# EAGLE schematic msc_onlab106 (EAGLE 6.1)
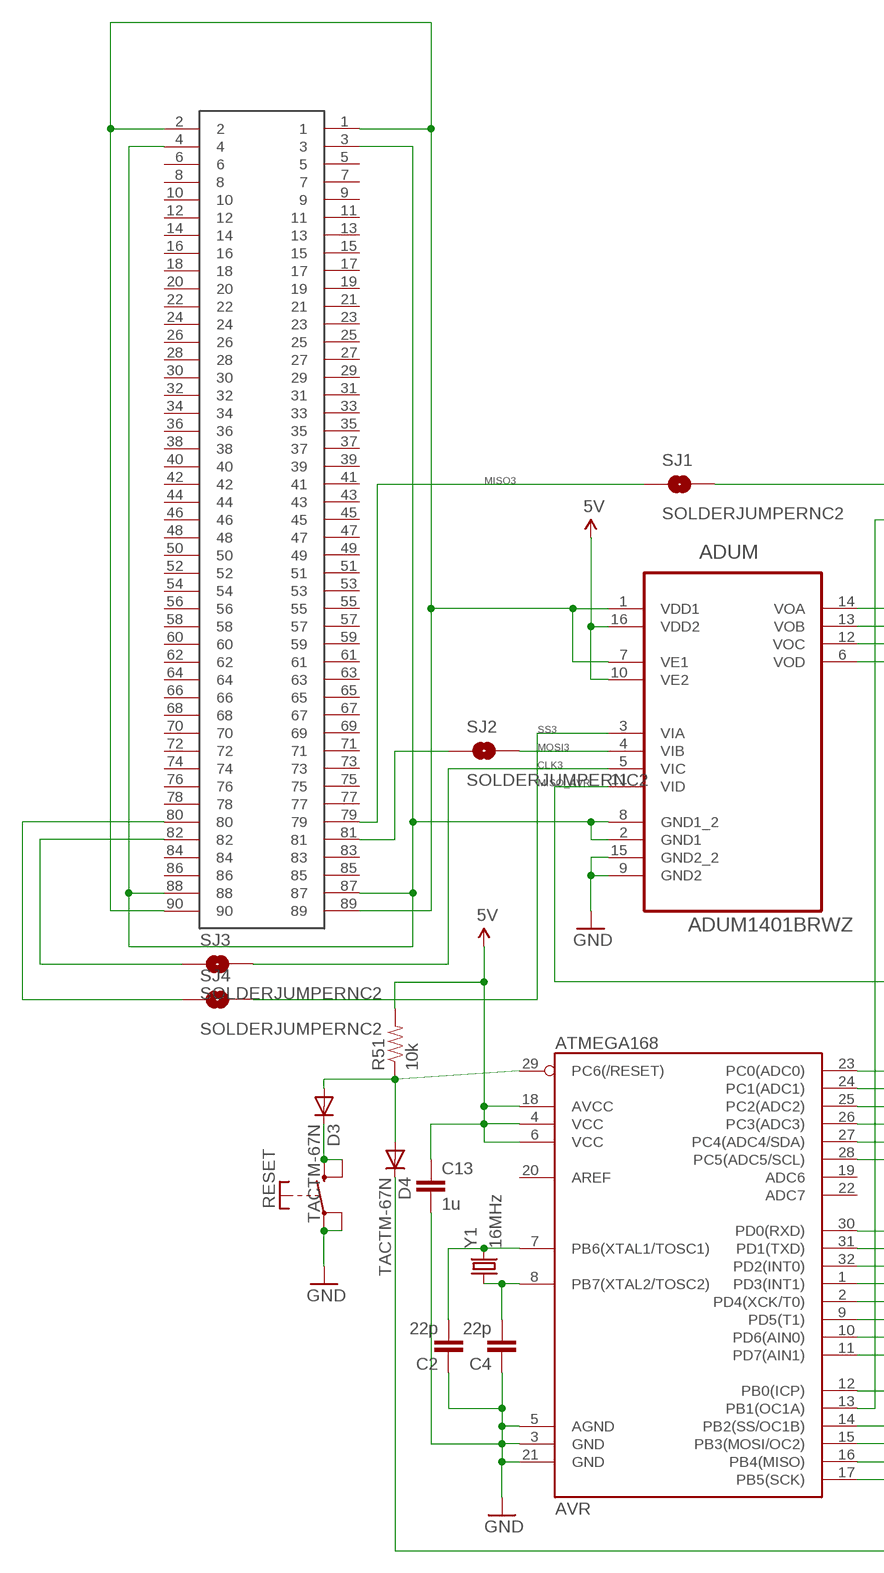
[diagram p0: schematic, sheet 1, part 1 of 2]
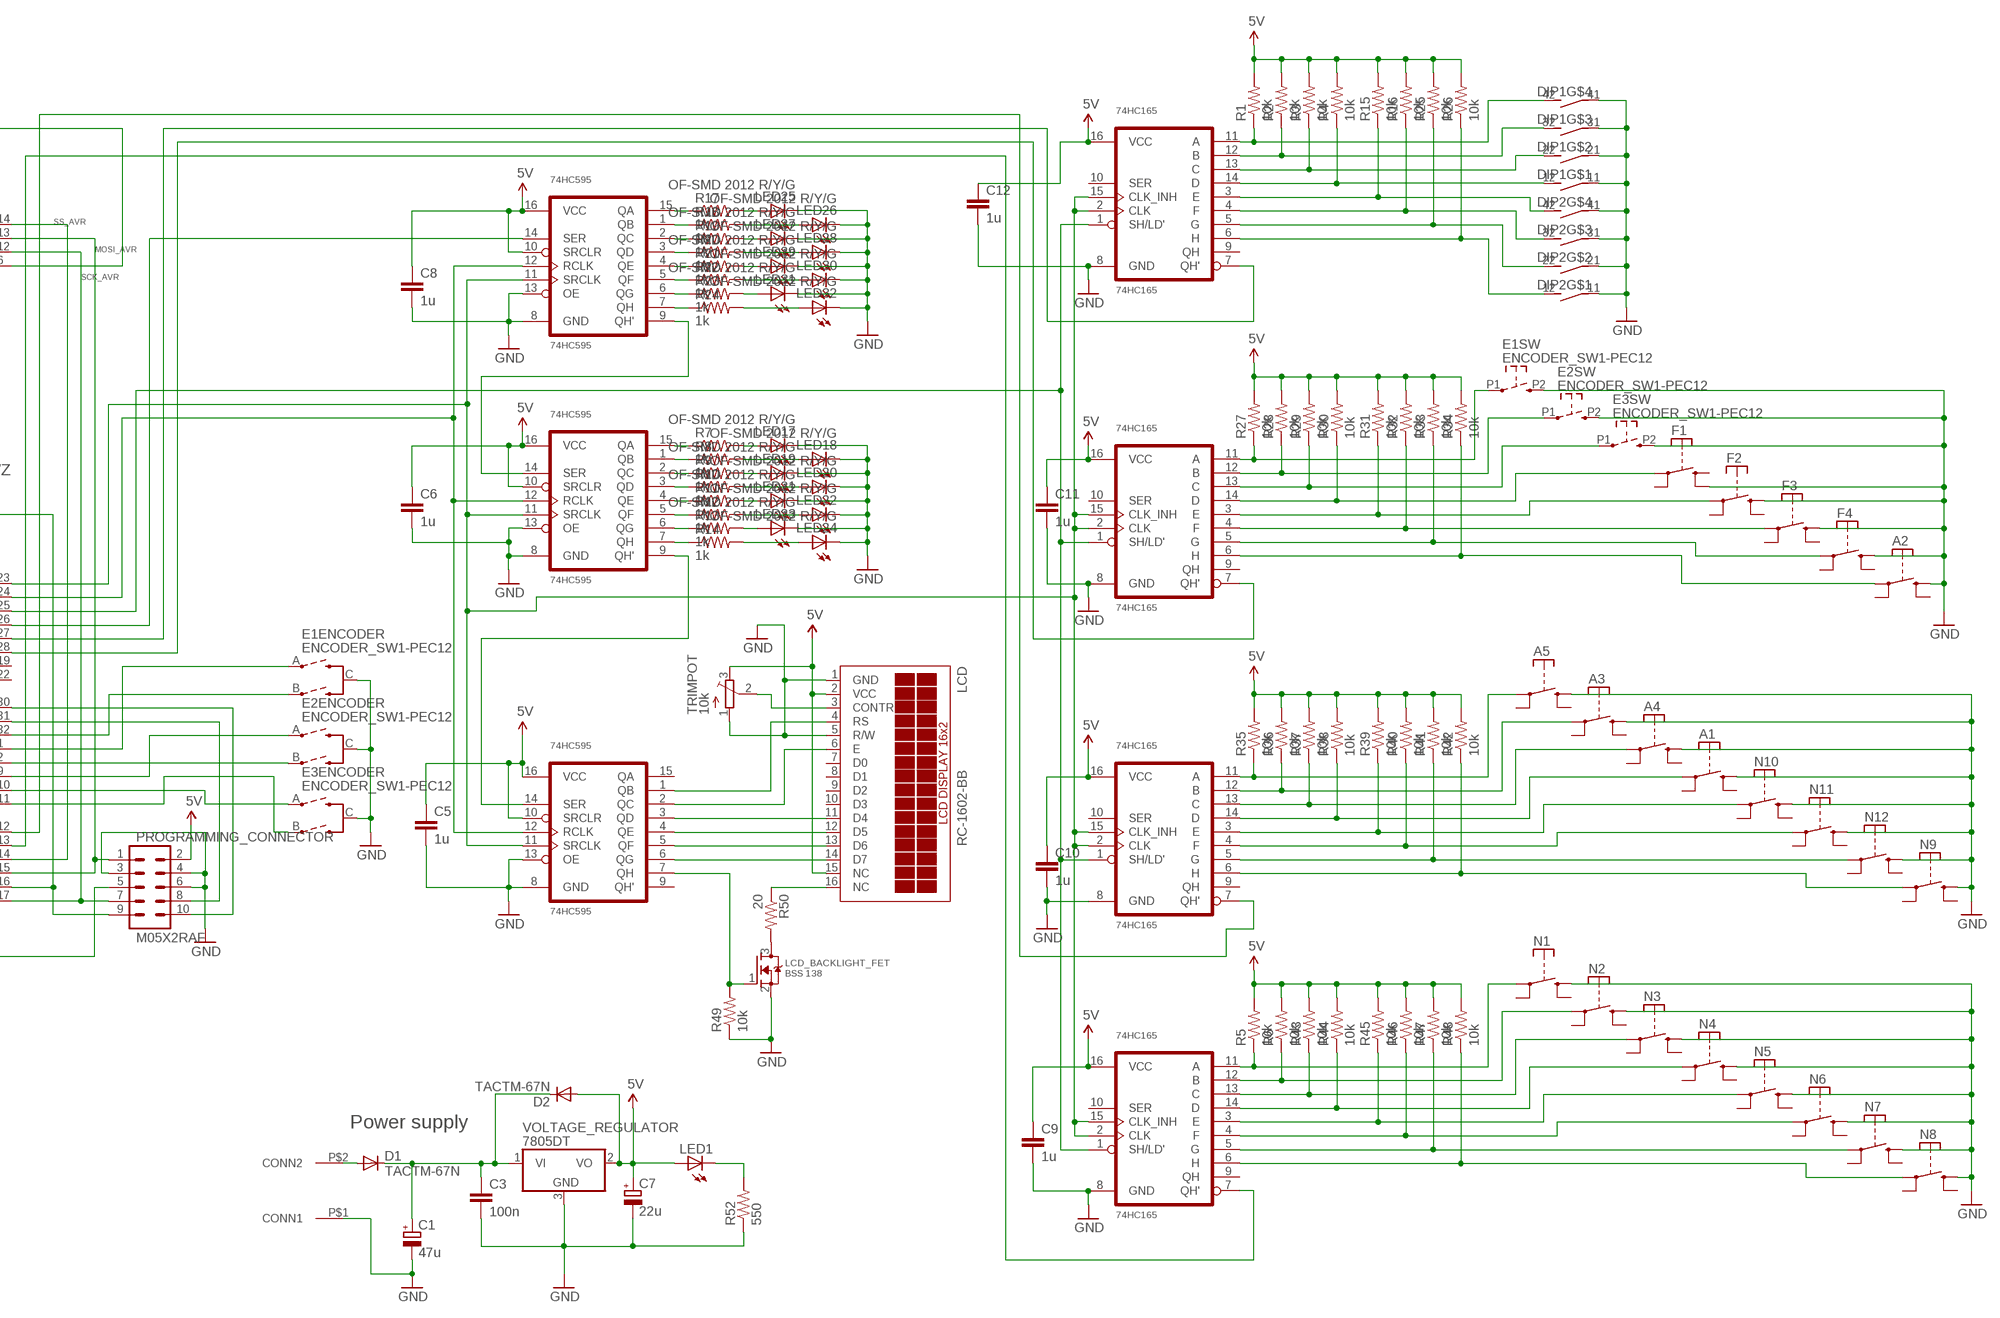
[diagram p1: schematic, sheet 1, part 2 of 2]

## Parts
A1  TACTM-67N  BUTTON_SMD  [SMD]
A2  TACTM-67N  BUTTON_SMD  [SMD]
A3  TACTM-67N  BUTTON_SMD  [SMD]
A4  TACTM-67N  BUTTON_SMD  [SMD]
A5  TACTM-67N  BUTTON_SMD  [SMD]
ADUM  ADUM1401BRWZ  [SOIC127P1032X265-16N]
AVR  ATMEGA168  [TQFP32-08]
C1  47u  CPOL-EUD/7343-31W  [D/7343-31W]
C2  22p  CAP0603-CAP  [0603-CAP]
C3  100n  C-EUC0805K  [C0805K]
C4  22p  CAP0603-CAP  [0603-CAP]
C5  1u  CAP0603-CAP  [0603-CAP]
C6  1u  CAP0603-CAP  [0603-CAP]
C7  22u  CPOL-EUSMCB  [SMC_B]
C8  1u  CAP0603-CAP  [0603-CAP]
C9  1u  CAP0603-CAP  [0603-CAP]
C10  1u  CAP0603-CAP  [0603-CAP]
C11  1u  CAP0603-CAP  [0603-CAP]
C12  1u  CAP0603-CAP  [0603-CAP]
C13  1u  CAP0603-CAP  [0603-CAP]
CONNECTOR  SAMTEC_TFC  [SAMTEC-TFC]
D1  TACTM-67N  DIODESMA-ALT  [SMA-DIODE_ALT]
D2  TACTM-67N  DIODESMA-ALT  [SMA-DIODE_ALT]
D3  TACTM-67N  DIODESMA-ALT  [SMA-DIODE_ALT]
D4  TACTM-67N  DIODESMA-ALT  [SMA-DIODE_ALT]
DIP1  DIP04PIANO  [DIP04PIANO]
DIP2  DIP04PIANO  [DIP04PIANO]
E1  ENCODER_SW1-PEC12  [PEC12_INCREMENTAL_ENCODER]
E2  ENCODER_SW1-PEC12  [PEC12_INCREMENTAL_ENCODER]
E3  ENCODER_SW1-PEC12  [PEC12_INCREMENTAL_ENCODER]
F1  TACTM-67N  BUTTON_SMD  [SMD]
F2  TACTM-67N  BUTTON_SMD  [SMD]
F3  TACTM-67N  BUTTON_SMD  [SMD]
F4  TACTM-67N  BUTTON_SMD  [SMD]
IN_1  74HC165  [TI_PW]
IN_2  74HC165  [TI_PW]
IN_3  74HC165  [TI_PW]
IN_4  74HC165  [TI_PW]
LCD  RC-1602-BB  TUXGR_16X2_R2  [TUXGR_16X2_R2]
LCD_BACKLIGHT_FET  BSS 138  MOSFET-NREFLOW  [SOT23]
LED1  LEDCHIPLED_0805  [CHIPLED_0805]
LED17  OF-SMD 2012 R/Y/G  LEDCHIPLED_0805  [CHIPLED_0805]
LED18  OF-SMD 2012 R/Y/G  LEDCHIPLED_0805  [CHIPLED_0805]
LED19  OF-SMD 2012 R/Y/G  LEDCHIPLED_0805  [CHIPLED_0805]
LED20  OF-SMD 2012 R/Y/G  LEDCHIPLED_0805  [CHIPLED_0805]
LED21  OF-SMD 2012 R/Y/G  LEDCHIPLED_0805  [CHIPLED_0805]
LED22  OF-SMD 2012 R/Y/G  LEDCHIPLED_0805  [CHIPLED_0805]
LED23  OF-SMD 2012 R/Y/G  LEDCHIPLED_0805  [CHIPLED_0805]
LED24  OF-SMD 2012 R/Y/G  LEDCHIPLED_0805  [CHIPLED_0805]
LED25  OF-SMD 2012 R/Y/G  LEDCHIPLED_0805  [CHIPLED_0805]
LED26  OF-SMD 2012 R/Y/G  LEDCHIPLED_0805  [CHIPLED_0805]
LED27  OF-SMD 2012 R/Y/G  LEDCHIPLED_0805  [CHIPLED_0805]
LED28  OF-SMD 2012 R/Y/G  LEDCHIPLED_0805  [CHIPLED_0805]
LED29  OF-SMD 2012 R/Y/G  LEDCHIPLED_0805  [CHIPLED_0805]
LED30  OF-SMD 2012 R/Y/G  LEDCHIPLED_0805  [CHIPLED_0805]
LED31  OF-SMD 2012 R/Y/G  LEDCHIPLED_0805  [CHIPLED_0805]
LED32  OF-SMD 2012 R/Y/G  LEDCHIPLED_0805  [CHIPLED_0805]
N1  TACTM-67N  BUTTON_SMD  [SMD]
N2  TACTM-67N  BUTTON_SMD  [SMD]
N3  TACTM-67N  BUTTON_SMD  [SMD]
N4  TACTM-67N  BUTTON_SMD  [SMD]
N5  TACTM-67N  BUTTON_SMD  [SMD]
N6  TACTM-67N  BUTTON_SMD  [SMD]
N7  TACTM-67N  BUTTON_SMD  [SMD]
N8  TACTM-67N  BUTTON_SMD  [SMD]
N9  TACTM-67N  BUTTON_SMD  [SMD]
N10  TACTM-67N  BUTTON_SMD  [SMD]
N11  TACTM-67N  BUTTON_SMD  [SMD]
N12  TACTM-67N  BUTTON_SMD  [SMD]
POWER_CONNECTOR  NSL39_2_CONNECTOR  [NSL39_2_CONNECTOR]
PROGRAMMING_CONNECTOR  M05X2RAF  [2X5-RAF]
R1  10k  RESISTOR0603-RES  [0603-RES]
R2  10k  RESISTOR0603-RES  [0603-RES]
R3  10k  RESISTOR0603-RES  [0603-RES]
R4  10k  RESISTOR0603-RES  [0603-RES]
R5  10k  RESISTOR0603-RES  [0603-RES]
R6  10k  RESISTOR0603-RES  [0603-RES]
R7  1k  RESISTOR0603-RES  [0603-RES]
R8  1k  RESISTOR0603-RES  [0603-RES]
R9  1k  RESISTOR0603-RES  [0603-RES]
R10  1k  RESISTOR0603-RES  [0603-RES]
R11  1k  RESISTOR0603-RES  [0603-RES]
R12  1k  RESISTOR0603-RES  [0603-RES]
R13  1k  RESISTOR0603-RES  [0603-RES]
R14  1k  RESISTOR0603-RES  [0603-RES]
R15  10k  RESISTOR0603-RES  [0603-RES]
R16  10k  RESISTOR0603-RES  [0603-RES]
R17  1k  RESISTOR0603-RES  [0603-RES]
R18  1k  RESISTOR0603-RES  [0603-RES]
R19  1k  RESISTOR0603-RES  [0603-RES]
R20  1k  RESISTOR0603-RES  [0603-RES]
R21  1k  RESISTOR0603-RES  [0603-RES]
R22  1k  RESISTOR0603-RES  [0603-RES]
R23  1k  RESISTOR0603-RES  [0603-RES]
R24  1k  RESISTOR0603-RES  [0603-RES]
R25  10k  RESISTOR0603-RES  [0603-RES]
R26  10k  RESISTOR0603-RES  [0603-RES]
R27  10k  RESISTOR0603-RES  [0603-RES]
R28  10k  RESISTOR0603-RES  [0603-RES]
R29  10k  RESISTOR0603-RES  [0603-RES]
R30  10k  RESISTOR0603-RES  [0603-RES]
R31  10k  RESISTOR0603-RES  [0603-RES]
R32  10k  RESISTOR0603-RES  [0603-RES]
R33  10k  RESISTOR0603-RES  [0603-RES]
R34  10k  RESISTOR0603-RES  [0603-RES]
R35  10k  RESISTOR0603-RES  [0603-RES]
R36  10k  RESISTOR0603-RES  [0603-RES]
R37  10k  RESISTOR0603-RES  [0603-RES]
R38  10k  RESISTOR0603-RES  [0603-RES]
R39  10k  RESISTOR0603-RES  [0603-RES]
R40  10k  RESISTOR0603-RES  [0603-RES]
R41  10k  RESISTOR0603-RES  [0603-RES]
R42  10k  RESISTOR0603-RES  [0603-RES]
R43  10k  RESISTOR0603-RES  [0603-RES]
R44  10k  RESISTOR0603-RES  [0603-RES]
R45  10k  RESISTOR0603-RES  [0603-RES]
R46  10k  RESISTOR0603-RES  [0603-RES]
R47  10k  RESISTOR0603-RES  [0603-RES]
R48  10k  RESISTOR0603-RES  [0603-RES]
R49  10k  RESISTOR0603-RES  [0603-RES]
R50  20  RESISTOR0603-RES  [0603-RES]
R51  10k  RESISTOR0603-RES  [0603-RES]
R52  550  RESISTOR0603-RES  [0603-RES]
RESET  NSG 39-2  BUTTON_SMD  [SMD]
SJ1  SOLDERJUMPERNC2  [SJ_2S-NOTRACE]
SJ2  SOLDERJUMPERNC2  [SJ_2S-NOTRACE]
SJ3  SOLDERJUMPERNC2  [SJ_2S-NOTRACE]
SJ4  SOLDERJUMPERNC2  [SJ_2S-NOTRACE]
SR_OUT1  74HC595  [TI_PW]
SR_OUT2  74HC595  [TI_PW]
SR_OUT3  74HC595  [TI_PW]
TRIMPOT  10k  TRIMPOTTC33X  [TC33X]
VOLTAGE_REGULATOR  7805DT  [TO252]
Y1  16MHz  CRYSTALSMD  [HC49UP]

## Nets
3V3: ADUM.1(VDD1) ADUM.7(VE1) CONNECTOR.1 CONNECTOR.2 CONNECTOR.89 CONNECTOR.90
3V3_GND: ADUM.2(GND1) ADUM.8(GND1_2) CONNECTOR.3 CONNECTOR.4 CONNECTOR.87 CONNECTOR.88
5V: ADUM.10(VE2) ADUM.16(VDD2) AVR.4(VCC) AVR.6(VCC) AVR.18(AVCC) C5.1 C6.1 C7.+ C8.1 C9.1 C10.1 C11.1 C12.1 C13.1 D2.A IN_1.16(VCC) IN_2.16(VCC) IN_3.16(VCC) IN_4.16(VCC) LCD.2(VCC) LCD.15(NC) LED1.A PROGRAMMING_CONNECTOR.2 R1.2 R2.2 R3.2 R4.2 R5.2 R6.2 R15.2 R16.2 R25.2 R26.2 R27.2 R28.2 R29.2 R30.2 R31.2 R32.2 R33.2 R34.2 R35.2 R36.2 R37.2 R38.2 R39.2 R40.2 R41.2 R42.2 R43.2 R44.2 R45.2 R46.2 R47.2 R48.2 R51.2 SR_OUT1.10(SRCLR) SR_OUT1.16(VCC) SR_OUT2.10(SRCLR) SR_OUT2.16(VCC) SR_OUT3.10(SRCLR) SR_OUT3.16(VCC) TRIMPOT.3(E) VOLTAGE_REGULATOR.2(VO)
CLK3: ADUM.5(VIC) SJ3.2
GND: A1.P$4(P) A2.P$4(P) A3.P$4(P) A4.P$4(P) A5.P$4(P) ADUM.9(GND2) ADUM.15(GND2_2) AVR.3(GND) AVR.5(AGND) AVR.21(GND) C1.- C2.1 C3.2 C4.1 C5.2 C6.2 C7.- C8.2 C9.2 C10.2 C11.2 C12.2 C13.2 DIP1.11 DIP1.21 DIP1.31 DIP1.41 DIP2.11 DIP2.21 DIP2.31 DIP2.41 E1.C(ENCODER:C) E1.P2 E2.C(ENCODER:C) E2.P2 E3.C(ENCODER:C) E3.P2 F1.P$3(P) F2.P$4(P) F3.P$4(P) F4.P$4(P) IN_1.8(GND) IN_2.8(GND) IN_3.8(GND) IN_4.8(GND) LCD.1(GND) LCD.5(R/W) LCD_BACKLIGHT_FET.2(S) LED17.C LED18.C LED19.C LED20.C LED21.C LED22.C LED23.C LED24.C LED25.C LED26.C LED27.C LED28.C LED29.C LED30.C LED31.C LED32.C N1.P$4(P) N2.P$4(P) N3.P$4(P) N4.P$4(P) N5.P$4(P) N6.P$4(P) N7.P$4(P) N8.P$4(P) N9.P$4(P) N10.P$4(P) N11.P$4(P) N12.P$4(P) POWER_CONNECTOR.P$1(CONN1) PROGRAMMING_CONNECTOR.3 PROGRAMMING_CONNECTOR.4 PROGRAMMING_CONNECTOR.6 R49.1 R52.1 RESET.P$1(P) RESET.P$2(P) SR_OUT1.8(GND) SR_OUT1.13(OE) SR_OUT2.8(GND) SR_OUT2.13(OE) SR_OUT3.8(GND) SR_OUT3.13(OE) TRIMPOT.1(A) VOLTAGE_REGULATOR.3(GND)
IN1A: DIP1.42 IN_1.11(A) R1.1
IN1B: DIP1.32 IN_1.12(B) R2.1
IN1C: DIP1.22 IN_1.13(C) R3.1
IN1D: DIP1.12 IN_1.14(D) R4.1
IN1E: DIP2.42 IN_1.3(E) R15.1
IN1F: DIP2.32 IN_1.4(F) R16.1
IN1G: DIP2.22 IN_1.5(G) R25.1
IN1H: DIP2.12 IN_1.6(H) R26.1
IN2A: E1.P1 IN_2.11(A) R27.1
IN2B: E2.P1 IN_2.12(B) R28.1
IN2C: E3.P1 IN_2.13(C) R29.1
IN2D: F1.P$2(P) IN_2.14(D) R30.1
IN2E: F2.P$2(P) IN_2.3(E) R31.1
IN2F: F3.P$2(P) IN_2.4(F) R32.1
IN2G: F4.P$2(P) IN_2.5(G) R33.1
IN2H: A2.P$2(P) IN_2.6(H) R34.1
IN3C: A4.P$2(P) IN_3.13(C) R37.1
IN3D: A1.P$2(P) IN_3.14(D) R38.1
IN3E: IN_3.3(E) N10.P$2(P) R39.1
IN3F: IN_3.4(F) N11.P$2(P) R40.1
IN3G: IN_3.5(G) N12.P$2(P) R41.1
IN3H: IN_3.6(H) N9.P$2(P) R42.1
IN4A: IN_4.11(A) N1.P$2(P) R5.1
IN4B: IN_4.12(B) N2.P$2(P) R6.1
IN4C: IN_4.13(C) N3.P$2(P) R43.1
IN4D: IN_4.14(D) N4.P$2(P) R44.1
IN4E: IN_4.3(E) N5.P$2(P) R45.1
IN4F: IN_4.4(F) N6.P$2(P) R46.1
IN4G: IN_4.5(G) N7.P$2(P) R47.1
IN4H: IN_4.6(H) N8.P$2(P) R48.1
IN_1: AVR.27(PC4(ADC4/SDA)) IN_1.7(QH')
IN_2: AVR.28(PC5(ADC5/SCL)) IN_2.7(QH')
IN_3: AVR.12(PB0(ICP)) IN_3.7(QH')
IN_4: AVR.13(PB1(OC1A)) IN_4.7(QH')
IN_LOAD: AVR.25(PC2(ADC2)) IN_1.1(SH/LD') IN_2.1(SH/LD') IN_3.1(SH/LD') IN_4.1(SH/LD')
IO_CLK: AVR.23(PC0(ADC0)) IN_1.2(CLK) IN_1.15(CLK_INH) IN_2.2(CLK) IN_2.15(CLK_INH) IN_3.2(CLK) IN_3.15(CLK_INH) IN_4.2(CLK) IN_4.15(CLK_INH) SR_OUT1.11(SRCLK) SR_OUT2.11(SRCLK) SR_OUT3.11(SRCLK)
MISO3: CONNECTOR.79 SJ1.1
MISO_AVR: ADUM.11(VID) AVR.16(PB4(MISO)) PROGRAMMING_CONNECTOR.9
MOSI3: CONNECTOR.81 SJ2.1
MOSI_AVR: ADUM.13(VOB) AVR.15(PB3(MOSI/OC2)) PROGRAMMING_CONNECTOR.1
N$1: A5.P$2(P) IN_3.11(A) R35.1
N$2: A3.P$2(P) IN_3.12(B) R36.1
N$3: LCD.14(D7) SR_OUT1.6(QG)
N$4: LCD.13(D6) SR_OUT1.5(QF)
N$5: LCD.3(CONTR) TRIMPOT.2(S)
N$6: LCD_BACKLIGHT_FET.1(G) R49.2 SR_OUT1.7(QH)
N$7: LCD_BACKLIGHT_FET.3(D) R50.2
N$8: LCD.16(NC) R50.1
N$9: LCD.12(D5) SR_OUT1.4(QE)
N$10: LCD.11(D4) SR_OUT1.3(QD)
N$11: LCD.6(E) SR_OUT1.2(QC)
N$12: D1.A POWER_CONNECTOR.P$2(CONN2)
N$13: LCD.4(RS) SR_OUT1.1(QB)
N$14: C1.+ C3.1 D1.C D2.C VOLTAGE_REGULATOR.1(VI)
N$17: AVR.32(PD2(INT0)) E1.B(ENCODER:B)
N$20: AVR.8(PB7(XTAL2/TOSC2)) C4.2 Y1.1
N$21: CONNECTOR.82 SJ3.1
N$22: CONNECTOR.80 SJ4.1
N$23: AVR.7(PB6(XTAL1/TOSC1)) C2.2 Y1.2
N$24: AVR.1(PD3(INT1)) E1.A(ENCODER:A)
N$25: AVR.2(PD4(XCK/T0)) E2.B(ENCODER:B)
N$27: AVR.9(PD5(T1)) E2.A(ENCODER:A)
N$28: LED1.C R52.2
N$29: ADUM.4(VIB) SJ2.2
N$30: AVR.10(PD6(AIN0)) E3.A(ENCODER:A)
N$31: ADUM.6(VOD) SJ1.2
N$32: AVR.11(PD7(AIN1)) E3.B(ENCODER:B)
N$33: R7.1 SR_OUT2.15(QA)
N$34: R8.1 SR_OUT2.1(QB)
N$35: R9.1 SR_OUT2.2(QC)
N$36: R10.1 SR_OUT2.3(QD)
N$37: R11.1 SR_OUT2.4(QE)
N$38: R12.1 SR_OUT2.5(QF)
N$39: R13.1 SR_OUT2.6(QG)
N$40: R14.1 SR_OUT2.7(QH)
N$41: LED17.A R7.2
N$42: LED18.A R8.2
N$43: LED19.A R9.2
N$44: LED20.A R10.2
N$45: LED21.A R11.2
N$46: LED22.A R12.2
N$47: LED23.A R13.2
N$48: LED24.A R14.2
N$49: R17.1 SR_OUT3.15(QA)
N$50: R18.1 SR_OUT3.1(QB)
N$51: R19.1 SR_OUT3.2(QC)
N$52: R20.1 SR_OUT3.3(QD)
N$53: R21.1 SR_OUT3.4(QE)
N$54: R22.1 SR_OUT3.5(QF)
N$55: R23.1 SR_OUT3.6(QG)
N$56: R24.1 SR_OUT3.7(QH)
N$57: LED25.A R17.2
N$58: LED26.A R18.2
N$59: LED27.A R19.2
N$60: LED28.A R20.2
N$61: LED29.A R21.2
N$62: LED30.A R22.2
N$63: LED31.A R23.2
N$64: LED32.A R24.2
N$65: AVR.29(PC6(/RESET)) D3.A D4.A R51.1
N$67: D3.C RESET.P$3(P) RESET.P$4(P)
OUT: AVR.26(PC3(ADC3)) SR_OUT3.14(SER)
OUT_DAISY: SR_OUT2.14(SER) SR_OUT3.9(QH')
OUT_DAISY2: SR_OUT1.14(SER) SR_OUT2.9(QH')
OUT_LATCH: AVR.24(PC1(ADC1)) SR_OUT1.12(RCLK) SR_OUT2.12(RCLK) SR_OUT3.12(RCLK)
RESET: D4.C PROGRAMMING_CONNECTOR.5
RX: AVR.30(PD0(RXD)) PROGRAMMING_CONNECTOR.10
SCK_AVR: ADUM.12(VOC) AVR.17(PB5(SCK)) PROGRAMMING_CONNECTOR.7
SS3: ADUM.3(VIA) SJ4.2
SS_AVR: ADUM.14(VOA) AVR.14(PB2(SS/OC1B))
TX: AVR.31(PD1(TXD)) PROGRAMMING_CONNECTOR.8
Unconnected: A1.P$1(P) A1.P$3(P) A2.P$1(P) A2.P$3(P) A3.P$1(P) A3.P$3(P) A4.P$1(P) A4.P$3(P) A5.P$1(P) A5.P$3(P) AVR.19(ADC6) AVR.20(AREF) AVR.22(ADC7) CONNECTOR.5 CONNECTOR.6 CONNECTOR.7 CONNECTOR.8 CONNECTOR.9 CONNECTOR.10 CONNECTOR.11 CONNECTOR.12 CONNECTOR.13 CONNECTOR.14 CONNECTOR.15 CONNECTOR.16 CONNECTOR.17 CONNECTOR.18 CONNECTOR.19 CONNECTOR.20 CONNECTOR.21 CONNECTOR.22 CONNECTOR.23 CONNECTOR.24 CONNECTOR.25 CONNECTOR.26 CONNECTOR.27 CONNECTOR.28 CONNECTOR.29 CONNECTOR.30 CONNECTOR.31 CONNECTOR.32 CONNECTOR.33 CONNECTOR.34 CONNECTOR.35 CONNECTOR.36 CONNECTOR.37 CONNECTOR.38 CONNECTOR.39 CONNECTOR.40 CONNECTOR.41 CONNECTOR.42 CONNECTOR.43 CONNECTOR.44 CONNECTOR.45 CONNECTOR.46 CONNECTOR.47 CONNECTOR.48 CONNECTOR.49 CONNECTOR.50 CONNECTOR.51 CONNECTOR.52 CONNECTOR.53 CONNECTOR.54 CONNECTOR.55 CONNECTOR.56 CONNECTOR.57 CONNECTOR.58 CONNECTOR.59 CONNECTOR.60 CONNECTOR.61 CONNECTOR.62 CONNECTOR.63 CONNECTOR.64 CONNECTOR.65 CONNECTOR.66 CONNECTOR.67 CONNECTOR.68 CONNECTOR.69 CONNECTOR.70 CONNECTOR.71 CONNECTOR.72 CONNECTOR.73 CONNECTOR.74 CONNECTOR.75 CONNECTOR.76 CONNECTOR.77 CONNECTOR.78 CONNECTOR.83 CONNECTOR.84 CONNECTOR.85 CONNECTOR.86 F1.P$1(P) F1.P$4(P) F2.P$1(P) F2.P$3(P) F3.P$1(P) F3.P$3(P) F4.P$1(P) F4.P$3(P) IN_1.9(QH) IN_1.10(SER) IN_2.9(QH) IN_2.10(SER) IN_3.9(QH) IN_3.10(SER) IN_4.9(QH) IN_4.10(SER) LCD.7(D0) LCD.8(D1) LCD.9(D2) LCD.10(D3) N1.P$1(P) N1.P$3(P) N2.P$1(P) N2.P$3(P) N3.P$1(P) N3.P$3(P) N4.P$1(P) N4.P$3(P) N5.P$1(P) N5.P$3(P) N6.P$1(P) N6.P$3(P) N7.P$1(P) N7.P$3(P) N8.P$1(P) N8.P$3(P) N9.P$1(P) N9.P$3(P) N10.P$1(P) N10.P$3(P) N11.P$1(P) N11.P$3(P) N12.P$1(P) N12.P$3(P) SR_OUT1.9(QH') SR_OUT1.15(QA)

## Notes on the sheet
- Power supply

## Library data of the parts
A1-A5 F1-F4 N1-N12 RESET = stibi:BUTTON
ADUM = Analog Devices_By_element14_Batch_1:ADUM1401BRWZ: Quad-Channel Digital Isolators; MPN: ADUM1401BRWZ; OC_FARNELL: 1226221; OC_NEWARK: 59K3278; PACKAGE: SOIC-16; SUPPLIER: Analog Devices
AVR = SparkFun:ATMEGA168
C1 = resistor:CPOL-EU: POLARIZED CAPACITOR, European symbol
C2 C4-C6 C8-C13 = SparkFun:CAP: Capacitor Standard 0603 ceramic capacitor, and 0.1" leaded capacitor.
C3 = rcl:C-EU: CAPACITOR, European symbol
C7 = rcl:CPOL-EU: POLARIZED CAPACITOR, European symbol
CONNECTOR = stibi:SAMTEC_TFC
D1-D4 = SparkFun:DIODE: Diode These are standard reverse protection diodes and small signal diodes. SMA package can handle up to about 1A. SOD-323 can handle about 200mA. What the SOD-323 package when ordering, there are some mfgs out there that are 5-pin packages.
DIP1 DIP2 = stibi:DIP04PIANO
E1-E3 = dp_devices:ENCODER_SW1: Incremental Encoder with push switch
IN_1-IN_4 = stibi:74HC165
LCD = display-lcd:TUXGR_16X2_R2: Tuxgraphics LCD display 16x2 characters reflective, without background light Source: tuxgr_12x2_r2.pdf; OC_FARNELL: unknown; OC_NEWARK: unknown
LCD_BACKLIGHT_FET = adafruit:MOSFET-N: N-Channel Mosfet 2N7002E - 60V 260mA SOT23 [Digikey: 2N7002ET1GOSTR-ND] - REEL BSH103 - 30V 850mA SOT23 [Digikey: 568-5013-1-ND]
LED1 LED17-LED32 = adafruit:LED: LED OSRAM: - CHIPLED LG R971, LG N971, LY N971, LG Q971, LY Q971, LO R971, LY R971 LH N974, LH R974 LS Q976, LO Q976, LY Q976 LO Q996 - Hyper CHIPLED LW Q18S LB Q993, LB Q99A, LB R99A - SideLED LS A670, LO A670, LY A670, LG A670, LP A670 LB A673, LV A673, LT A673, LW A673 LH A674 LY A675 LS A676, LA A676, LO A676, LY A676, LW A676 LS A679, LY A679, LG A679 - Hyper Micro SIDELED® LS Y876, LA Y876, LO Y876, LY Y876 LT Y87S - SmartLED LW L88C, LW L88S LB L89C, LB L89S, LG L890 LS L89K, LO L89K, LY L89K LS L896, LA L896, LO L896, LY L896 - TOPLED LS T670, LO T670, LY T670, LG T670, LP T670 LSG T670, LSP T670, LSY T670, LOP T670, LYG T670 LG T671, LOG T671, LSG T671 LB T673, LV T673, LT T673, LW T673 LH T674 LS T676, LA T676, LO T676, LY T676, LB T676, LH T676, LSB T676, LW T676 LB T67C, LV T67C, LT T67C, LS T67K, LO T67K, LY T67K, LW E67C LS E67B, LA E67B, LO E67B, LY E67B, LB E67C, LV E67C, LT E67C LW T67C LS T679, LY T679, LG T679 LS T770, LO T770, LY T770, LG T770, LP T770 LB T773, LV T773, LT T773, LW T773 LH T774 LS E675, LA E675, LY E675, LS T675 LS T776, LA T776, LO T776, LY T776, LB T776 LHGB T686 LT T68C, LB T68C - Hyper Mini TOPLED® LB M676 - Mini TOPLED Santana® LG M470 LS M47K, LO M47K, LY M47K Source: http://www.osram.convergy.de/
POWER_CONNECTOR = stibi:NSL39_2_CONNECTOR
PROGRAMMING_CONNECTOR = SparkFun:M05X2: Header 5x2 Standard 10-pin dual row 0.1" header. Commonly used with AVR-ISP. Use with Spark Fun Electronics SKU: PRT-00778
R1-R52 = SparkFun:RESISTOR: Resistor Basic schematic elements and footprints for 0603, 1206, and PTH resistors.
SJ1-SJ4 = SparkFun:SOLDERJUMPER: Solder Jumper Standard SMD solder jumper. Used to automate production. Two varients : Normally Open and Normally Closed are the same, but have different paste layers. NC will have a large amount of paste and should jumper during reflow.
SR_OUT1-SR_OUT3 = stibi:74HC595
TRIMPOT = adafruit:TRIMPOT: SMT trimmer potentiometer part number TC33X http://www.ladyada.net/library/eagle
VOLTAGE_REGULATOR = linear:78*: Positive VOLTAGE REGULATOR Source: http://cache.national.com/ds/LM/LM78L05.pdf http://www.fairchildsemi.com/ds/LM/LM7805.pdf
Y1 = SparkFun:CRYSTAL: Crystals Various standard crystals. Proven footprints. Spark Fun Electronics SKU : COM-00534